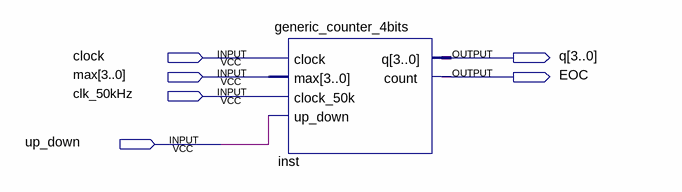
[diagram p0: schematic sheet]
// Quartus schematic generic_counter_4bits_test.bdf as structural Verilog: 1 symbols, 6 pins
module generic_counter_4bits_test (
  input  clock,
  input  [3:0] max,
  input  clk_50kHz,
  input  up_down,
  output [3:0] q,
  output EOC
);

  generic_counter_4bits inst (.clock(clock), .max(max), .clock_50k(clk_50kHz), .up_down(up_down), .q(q), .count(EOC));
endmodule
